# EAGLE design EFR32MG22_module (EAGLE 9.6.2)
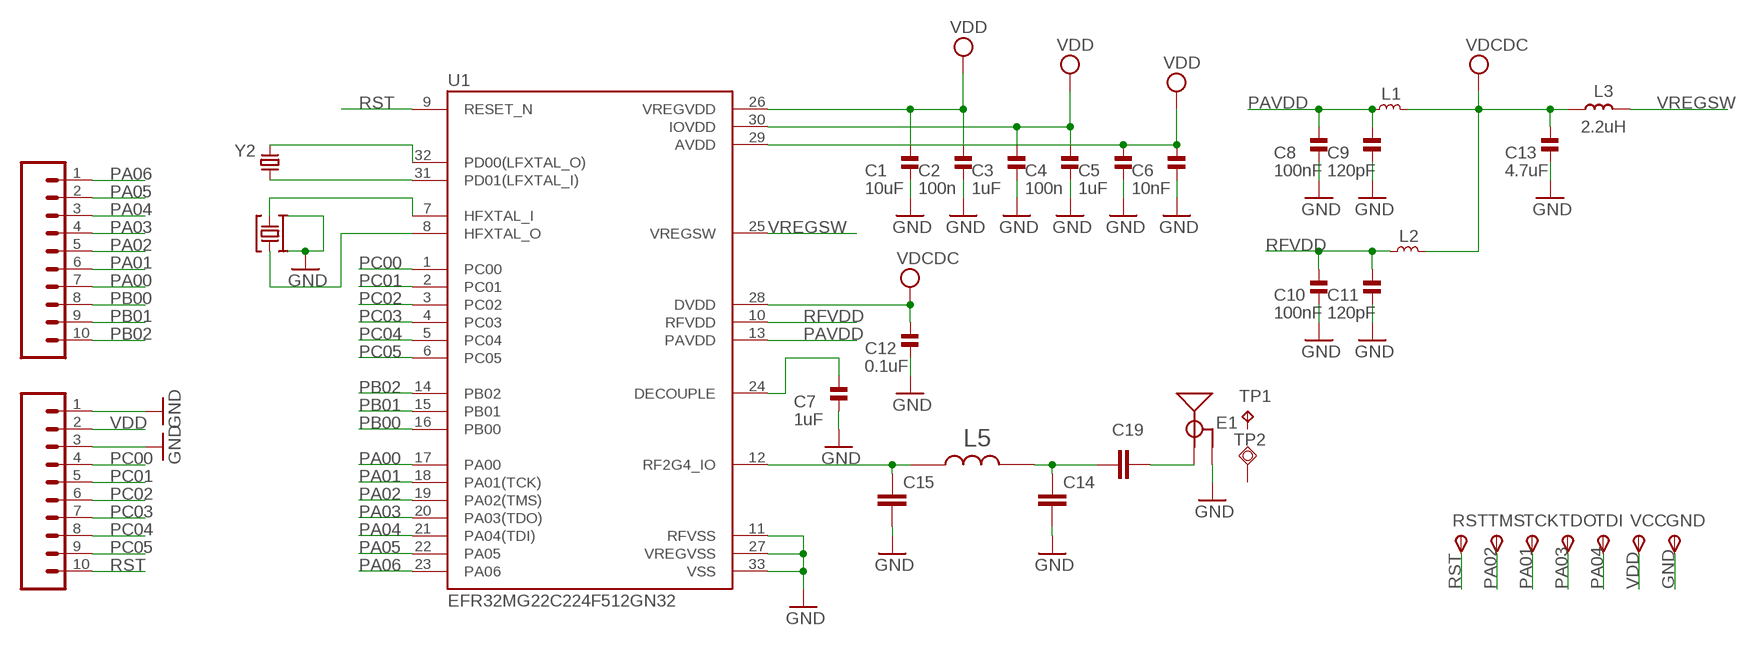
[diagram p0: schematic, sheet 1]

## Parts
C1  10uF  CAP-0805  [_PKG_C_0805]
C2  100n  CAP-0402  [_PKG_C_0402]
C3  1uF  CAP-0402  [_PKG_C_0402]
C4  100n  CAP-0402  [_PKG_C_0402]
C5  1uF  CAP-0402  [_PKG_C_0402]
C6  10nF  CAP-0402  [_PKG_C_0402]
C7  1uF  CAP-0402  [_PKG_C_0402]
C8  100nF  CAP-0402  [_PKG_C_0402]
C9  120pF  CAP-0402  [_PKG_C_0402]
C10  100nF  CAP-0402  [_PKG_C_0402]
C11  120pF  CAP-0402  [_PKG_C_0402]
C12  0.1uF  CAP-0402  [_PKG_C_0402]
C13  4.7uF  CAP-0402  [_PKG_C_0402]
C14  1.3pF  CAP0402  [CAPC1005X40N]
C15  1.2pF  CAP0402  [CAPC1005X40N]
C19  18pF  CAP0402  [CAPC1005X40N]
E1  ANTENNA-GROUNDEDTRACE-15.2MM  [TRACE_ANTENNA_2.4GHZ_15.2MM]
GND  TPSTP11R  [TP11R]
J1  CONN_061.27MM  [1X06_1.27MM]
J2  CONN_061.27MM  [1X06_1.27MM]
L1  BLM18AG102SN1  INDUCTOR-0603  [_PKG_L_0603]
L2  BLM18AG102SN1  INDUCTOR-0603  [_PKG_L_0603]
L3  2.2uH  L_CHIP-1008(2520-METRIC)  [INDC2520X120N]
L5  2.6nH  IND0402IND0402  [INDC1005X40N]
RST  TPSTP11R  [TP11R]
TCK  TPSTP11R  [TP11R]
TDI  TPSTP11R  [TP11R]
TDO  TPSTP11R  [TP11R]
TMS  TPSTP11R  [TP11R]
TP1  TPTP06SQ  [TP05SQ]
TP2  TPSQTP15SQ  [TP15SQ]
U1  EFR32MG22C224F512GN32  [QFN50P500X500X90-33N]
VCC  TPSTP11R  [TP11R]
Y1  38.4MHZ  48.000MHZ_CX2016DB48000C0FPLC1  [XTAL-4P-2016]
Y2  32.768KHz  32.768KHZ_Q13FC1350000400  [XTAL-2P-3215]

## Nets
GND: C1.2 C2.2 C3.2 C4.2 C5.2 C6.2 C7.2 C8.2 C9.2 C10.2 C11.2 C12.2 C13.2 C14.2 C15.2 E1.GND GND.TP(PP) J2.1 J2.3 U1.11(RFVSS) U1.27(VREGVSS) U1.33(VSS) Y1.2 Y1.4
N$1: C15.1 L5.1 U1.12(RF2G4_IO)
N$2: C7.1 U1.24(DECOUPLE)
N$3: U1.7(HFXTAL_I) Y1.3
N$5: U1.31(PD01(LFXTAL_I)) Y2.2
N$6: U1.32(PD00(LFXTAL_O)) Y2.1
N$7: C14.1 C19.1 L5.2
N$8: C19.2 E1.ANT(SIGNAL)
N$9: U1.8(HFXTAL_O) Y1.1
PA00: J1.7 U1.17(PA00)
PA01: J1.6 TCK.TP(PP) U1.18(PA01(TCK))
PA02: J1.5 TMS.TP(PP) U1.19(PA02(TMS))
PA03: J1.4 TDO.TP(PP) U1.20(PA03(TDO))
PA04: J1.3 TDI.TP(PP) U1.21(PA04(TDI))
PA05: J1.2 U1.22(PA05)
PA06: J1.1 U1.23(PA06)
PAVDD: C8.1 C9.1 L1.1 U1.13(PAVDD)
PB00: J1.8 U1.16(PB00)
PB01: J1.9 U1.15(PB01)
PB02: J1.10 U1.14(PB02)
PC00: J2.4 U1.1(PC00)
PC01: J2.5 U1.2(PC01)
PC02: J2.6 U1.3(PC02)
PC03: J2.7 U1.4(PC03)
PC04: J2.8 U1.5(PC04)
PC05: J2.9 U1.6(PC05)
RFVDD: C10.1 C11.1 L2.1 U1.10(RFVDD)
RST: J2.10 RST.TP(PP) U1.9(RESET_N)
VDD: C1.1 C2.1 C3.1 C4.1 C5.1 C6.1 J2.2 U1.26(VREGVDD) U1.29(AVDD) U1.30(IOVDD) VCC.TP(PP)
VPP: C12.1 C13.1 L1.2 L2.2 L3.1 U1.28(DVDD) ; supply symbol labelled VDCDC
VREGSW: L3.2 U1.25(VREGSW)
Unconnected: TP1.TP TP2.TP

## Library data of the parts
C1-C13 = ok-discretes-dev:CAP
C14 C15 C19 = discretes-dev:CAP0402: CAP, 0402; AVAILABILITY: Good; DESCRIPTION: RESISTOR, 0402 0.063W 1% 3M6; Resistance:3.6Mohm; Resistance Tolerance:± 1%; Power Rating:0.063W; Voltage Rating:50V; Series:RC32H; Temperature Coefficient:± 100ppm/°C; Resistor Element Type:Thick Film; Resistor Case Style:0402; No. of Pins:2; SVHC:No SVHC; Case Style:0402; External Length / Height:1mm; Temperature Coeff. +:100ppm/°C; Temperature Coeff. -:100ppm/°C; External Depth:0.35mm; External Width:0.5mm; Operating Temperature Range:-55°C to +155°C; Overload Voltage:100V; MF: Yageo; MP: RC0402FR-073M6L; PACKAGE: 1005 Panasonic Electronic Components; PRICE: None; PURCHASE-URL: https://pricing.snapeda.com/search/part/RC0402FR-073M6L/?ref=eda
E1 = SparkFun-RF:ANTENNA-GROUNDED: Antenna w/ Ground Connection 2.4GHz antennae with signal and ground terminals. TRACE_ANTENNA_2.4GHZ_15.2MM - Meander Trace antenna 15.2 x 5.7mm footprint Based on layout from TI app note AN043 <http://www.ti.com/lit/an/swra117d/swra117d.pdf>. TRACE_ANTENNA_2.4GHZ_25.7MM - Inverted F trace antenna 25.7 x 7.5 mm footprint. Based on layout from TI design note DN0007 <http://www.ti.com/lit/an/swru120b/swru120b.pdf>.
GND RST TCK TDI TDO TMS VCC = testpad:TPS: TEST PIN
J1 J2 = SparkFun-Connectors:CONN_06: Multi connection point. Often used as Generic Header-pin footprint for 0.1 inch spaced/style header connections On any of the 0.1 inch spaced packages, you can populate with these: Break Away Headers - Straight <https://www.sparkfun.com/products/116> (PRT-00116) Break Away Male Headers - Right Angle <https://www.sparkfun.com/products/553> (PRT-00553) Female Headers <https://www.sparkfun.com/products/115> (PRT-00115) Break Away Headers - Machine Pin <https://www.sparkfun.com/products/117> (PRT-00117) Break Away Female Headers - Swiss Machine Pin <https://www.sparkfun.com/products/743> (PRT-00743) Arduino Stackable Header - 6 Pin <https://www.sparkfun.com/products/9280> (PRT-09280) For SCREWTERMINALS and SPRING TERMINALS visit here: Screw Terimnals on SparkFun.com <https://www.sparkfun.com/search/results?term=Screw+Terminals> (5mm/3.5mm/2.54mm spacing) This device is also useful as a general connection point to wire up your design to another part of your project. Our various solder wires solder well into these plated through hole pads. Hook-Up Wire - Assortment (Stranded, 22 AWG) <https://www.sparkfun.com/products/11375> (PRT-11375) Hook-Up Wire - Assortment (Solid Core, 22 AWG) <https://www.sparkfun.com/products/11367> (PRT-11367) View the entire wire category on our website here <https://www.sparkfun.com/categories/141>
L1 L2 = ok-discretes-dev:INDUCTOR
L3 = Inductor:L: Inductor Fixed - Generic; CATEGORY: Inductor; SUB-CATEGORY: Fixed
L5 = discretes-dev:IND0402: RESISTOR, 0402 0.063W 1% 3M6; Resistance:3.6Mohm; Resistance Tolerance:± 1%; Power Rating:0.063W; Voltage Rating:50V; Series:RC32H; Temperature Coefficient:± 100ppm/°C; Resistor Element Type:Thick Film; Resistor Case Style:0402; No. of Pins:2; SVHC:No SVHC; Case Style:0402; External Length / Height:1mm; Temperature Coeff. +:100ppm/°C; Temperature Coeff. -:100ppm/°C; External Depth:0.35mm; External Width:0.5mm; Operating Temperature Range:-55°C to +155°C; Overload Voltage:100V Check prices <https://pricing.snapeda.com/parts/RC0402FR-073M6L/Yageo/view-part?ref=eda>; AVAILABILITY: Good; DESCRIPTION: RESISTOR, 0402 0.063W 1% 3M6; Resistance:3.6Mohm; Resistance Tolerance:± 1%; Power Rating:0.063W; Voltage Rating:50V; Series:RC32H; Temperature Coefficient:± 100ppm/°C; Resistor Element Type:Thick Film; Resistor Case Style:0402; No. of Pins:2; SVHC:No SVHC; Case Style:0402; External Length / Height:1mm; Temperature Coeff. +:100ppm/°C; Temperature Coeff. -:100ppm/°C; External Depth:0.35mm; External Width:0.5mm; Operating Temperature Range:-55°C to +155°C; Overload Voltage:100V; MF: Yageo; MP: RC0402FR-073M6L; PACKAGE: 1005 Panasonic Electronic Components; PRICE: None; PURCHASE-URL: https://pricing.snapeda.com/search/part/RC0402FR-073M6L/?ref=eda
TP1 = testpad:TP: Test pad
TP2 = testpad:TPSQ: Test pad
U1 = EFR32MG22C224F512GN32:EFR32MG22C224F512GN32: SOC EFR32 ARM Cortex M33 32-Pin QFN; AVAILABILITY: In Stock; DESCRIPTION: MIGHTY PREMIUM QFN32 2.4G 19.5DB; MF: Silicon Labs; MP: EFR32MG14P732F256GM32-B; PACKAGE: QFN-32 Silicon Labs; PRICE: None
Y1 = ok-xtal-osc-dev:48.000MHZ_CX2016DB48000C0FPLC1: 48MHz ±10ppm Crystal 7pF 50 Ohms 4-SMD, No Lead Datasheet <https://media.digikey.com/pdf/Data%20Sheets/Kyocera%20International/CX2016DB48000C0FPLC1_DS.pdf>; DIGIKEY_PART: 1253-2042-1-ND; MFG_NAME: KYOCERA; MFG_PART: CX2016DB48000C0FPLC1
Y2 = ok-xtal-osc-dev:32.768KHZ_Q13FC1350000400: SMD Crystal Resonators 32.768KHz +/-20ppm SMD-3215_2P RoHS Datasheet <https://datasheet.lcsc.com/szlcsc/1901081604_Seiko-Epson-Q13FC1350000400_C32346.pdf>; LCSC_PART: C32346; MFG_NAME: SEIKO EPSON; MFG_PART: Q13FC1350000400

## Board
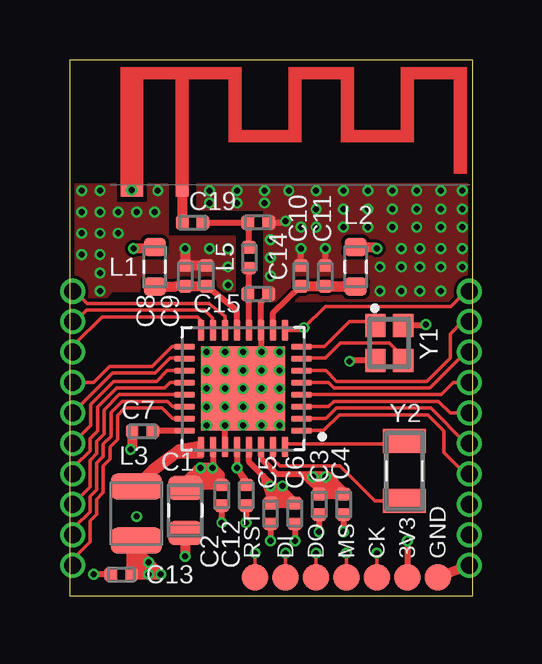
[diagram p1: board, top side]
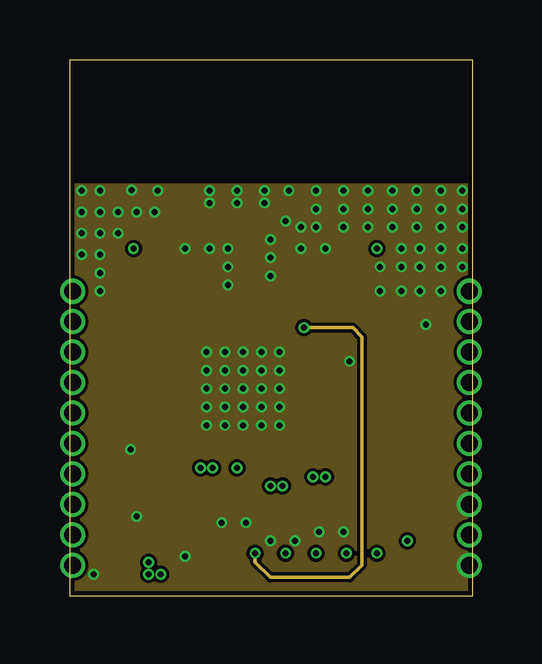
[diagram p2: board, inner layer Route2]
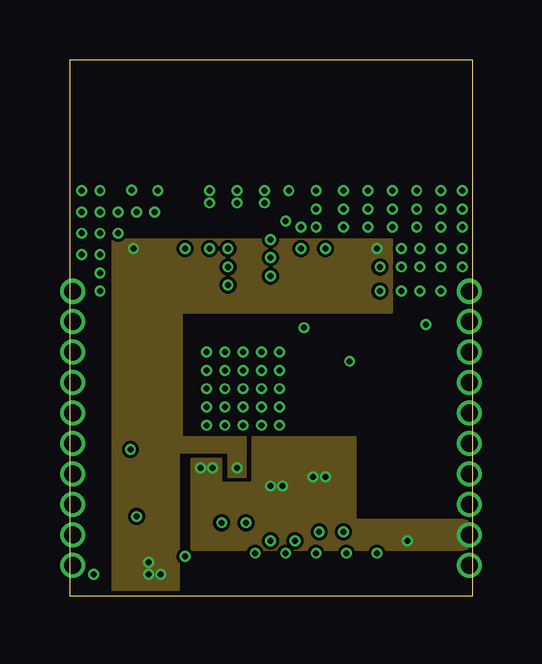
[diagram p3: board, inner layer Route15]
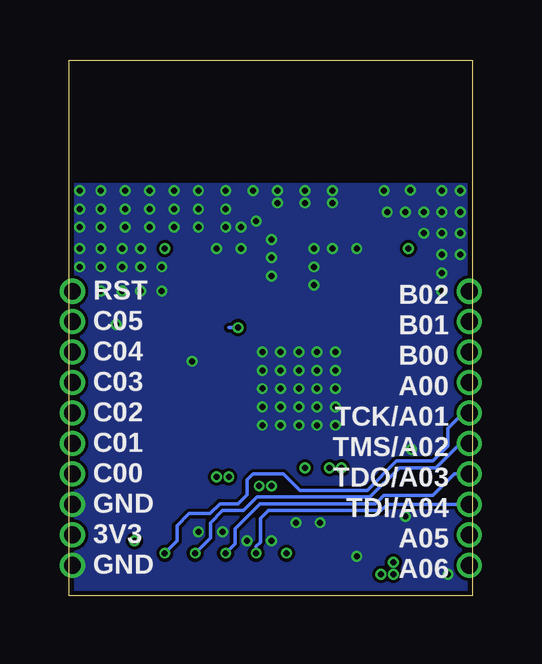
[diagram p4: board, bottom side, seen from below]

Size 16.82 x 22.34 mm. Coordinates in mm from the lower left corner, seen from the top.
Outline: 0,0 16.82,0 16.82,22.34 0,22.34 0,0
Copper layers (1*2*15*16): Top 0.035mm / dielectric 0.17mm / Route2 0.017mm / dielectric 0.4mm / Route15 0.017mm / dielectric 0.17mm / Bottom 0.035mm
Design rules "default *": minimum track width 6mil, minimum drill 0.2mm, track to track 5mil, track to pad 5mil, pad to pad 5mil, via to via 5mil, smd to smd 5mil, copper to edge 0.2mm, drill to drill 0.2mm, minimum pad ring 4mil, minimum via ring 4mil, stop-mask expansion 2.5mil, vias tented up to drill 0.25mm, thermal gap 10mil

### Footprints (pad centres in the part's own frame; a part is rotated, then mirrored left to right if it is on the bottom)
_PKG_C_0805 = smd 1 x 1.42: 1 -0.935,0; 2 0.935,0
_PKG_C_0402 = smd 0.54 x 0.6: 1 -0.43,0; 2 0.43,0
CAPC1005X40N = smd 0.54 x 0.6: 1 -0.432,0; 2 0.432,0
TRACE_ANTENNA_2.4GHZ_15.2MM = smd 0.5 x 0.5: ANT 0,-0.25 | smd 0.9 x 0.5: GND -2.1,-0.25
TP11R = smd 1.1 x 1.1: TP 0,0
1X06_1.27MM = drill 0.7 pad 1: 1 0,0; 2 1.27,0; 3 2.54,0; 4 3.81,0; 5 5.08,0; 6 6.35,0; 7 7.62,0; 8 8.89,0; 9 10.16,0; 10 11.43,0
_PKG_L_0603 = smd 0.79 x 0.93: 1 -0.82,0; 2 0.82,0
INDC2520X120N = smd 1.079 x 2.129: 1 -1.125,0; 2 1.125,0
INDC1005X40N = smd 0.54 x 0.6: 1 -0.432,0; 2 0.432,0
TP05SQ = smd 0.5 x 0.5: TP 0,0
TP15SQ = smd 0.5 x 0.9: TP 0,0
QFN50P500X500X90-33N = smd 0.86 x 0.26: 1 -2.435,1.75; 2 -2.435,1.25; 3 -2.435,0.75; 4 -2.435,0.25; 5 -2.435,-0.25; 6 -2.435,-0.75; 7 -2.435,-1.25; 8 -2.435,-1.75; 17 2.435,-1.75; 18 2.435,-1.25; 19 2.435,-0.75; 20 2.435,-0.25; 21 2.435,0.25; 22 2.435,0.75; 23 2.435,1.25; 24 2.435,1.75 | smd 0.26 x 0.86: 9 -1.75,-2.435; 10 -1.25,-2.435; 11 -0.75,-2.435; 12 -0.25,-2.435; 13 0.25,-2.435; 14 0.75,-2.435; 15 1.25,-2.435; 16 1.75,-2.435; 25 1.75,2.435; 26 1.25,2.435; 27 0.75,2.435; 28 0.25,2.435; 29 -0.25,2.435; 30 -0.75,2.435; 31 -1.25,2.435; 32 -1.75,2.435 | smd 3.5 x 3.5: 33 0,0
XTAL-4P-2016 = smd 0.95 x 0.85: 1 -0.725,-0.575; 2 0.725,-0.575; 3 0.725,0.575; 4 -0.725,0.575
XTAL-2P-3215 = smd 1 x 1.8: 1 -1.25,0; 2 1.25,0

### Placement (x,y rotation side)
C1  4.83,3.56 270 top
C2  6.35,4.19 270 top
C3  10.41,3.81 270 top
C4  11.43,3.81 270 top
C5  8.38,3.43 270 top
C6  9.4,3.43 270 top
C7  3.05,6.86 180 top
C8  4.83,13.34 90 top
C9  5.71,13.34 90 top
C10  9.65,13.34 90 top
C11  10.67,13.34 90 top
C12  7.37,4.19 270 top
C13  2.16,0.89 180 top
C14  7.87,15.56 0 top
C15  7.87,12.57 0 top
C19  5.13,15.56 180 top
E1  4.7,17.14 0 top
GND  15.37,0.76 0 top
J1  0.13,1.27 90 top
J2  16.68,1.27 90 top
L1  3.56,13.72 90 top
L2  11.94,13.72 90 top
L3  2.79,3.43 90 top
L5  7.49,14.1 90 top
RST  7.75,0.76 0 top
TCK  12.83,0.76 0 top
TDI  9.02,0.76 0 top
TDO  10.29,0.76 0 top
TMS  11.56,0.76 0 top
TP1  4.7,16.9 0 top
TP2  2.6,16.9 90 top
U1  7.24,8.64 180 top
VCC  14.1,0.76 0 top
Y1  13.34,10.54 270 top
Y2  13.97,5.21 270 top

### Tracks (layer width: path | path; a pad name or v marks a point on that pad's centre or on a via)
GND  (via drill 0.25)
  Top 0.152: v2.59,16.9 E1.GND v2.59,16.9 v2.59,16.91
  Top 0.254: v8,9.4 U1.11 7.99,12.26 C15.2 | U1.27 v6.49,7.1 v6.48,7.11 | C5.2 v8.38,2.29 | C6.2 v9.4,2.29 | C3.2 v10.41,2.67 | C4.2 v11.43,2.67 | C12.2 v7.37,3.05 | C2.2 v6.35,3.05 | C10.2 v9.65,14.48 | C11.2 v10.67,14.48 | C14.2 8.96,15.56 v9.02,15.62 | C13.2 v1.02,0.89 | v14.86,11.3 14.82,11.27 Y1.4 | Y1.2 11.72,9.82 v11.68,9.78
  Top 0.406: C7.2 2.62,6.17 v2.54,6.1 | C9.2 C8.2 v4.83,14.48 | C1.2 v4.83,1.65 | J2.1 GND.TP
  other vias: 5.71,10.16 8.76,10.16 7.24,10.16 6.48,10.16 8,10.16 5.71,7.11 8.76,7.11 5.71,8.64 5.71,9.4 5.71,7.87 7.24,7.11 8,7.11 8.76,8.64 8.76,9.4 8.76,7.87 6.48,9.4 7.24,9.4 6.48,8.64 6.48,7.87 7.24,8.64 7.24,7.87 8,8.64 8,7.87 0.51,16 0.51,15.11 0.51,14.22 1.27,16 1.27,15.11 1.27,14.22 2.03,16 2.79,16 3.56,16 9.65,15.37 11.43,15.37 12.45,15.37 13.46,15.37 14.48,15.37 15.49,15.37 16.38,15.37 13.84,14.48 15.49,14.48 16.38,14.48 13.84,13.72 15.49,13.72 16.38,13.72 13.84,12.7 15.49,12.7 12.45,16.13 13.46,16.13 14.48,16.13 15.49,16.13 16.38,16.13 2.03,15.11 1.27,13.46 14.61,14.48 14.61,13.72 14.61,12.7 6.6,12.95 8.38,14.86 8.38,13.34 11.43,16.13 10.29,15.37 12.95,12.7 12.95,13.72 6.6,14.48 5.84,14.48 6.6,13.72 2.79,3.3 8.38,14.1 1.27,12.7 11.43,16.89 12.45,16.89 13.46,16.89 14.48,16.89 15.49,16.89 16.38,16.89 10.29,16.89 10.29,16.13 9.14,16.89 8.13,16.89 6.99,16.89 5.84,16.89 3.68,16.89 0.51,16.89 1.27,16.89 5.84,16.38 6.99,16.38 8.13,16.38
  pour Bottom (no thermals): 16.76,17.14 16.76,-0.13 0,-0.13 0,17.14
  pour Route2 (no thermals): 0,17.14 16.76,17.14 16.76,-0.13 0,-0.13
  pour Top (no thermals): 0,17.14 1.91,17.14 1.91,16.38 3.3,16.38 3.3,17.14 4.06,17.14 4.06,14.99 6.86,14.99 6.86,12.7 1.78,12.7 1.4,12.32 0,12.32
  pour Top (no thermals): 5.33,17.14 5.33,16.13 8.13,16.13 8.13,12.32 16.76,12.32 16.76,17.14
N$1
  Top 0.254: U1.12 7.49,12.57 C15.1 7.49,12.62 L5.1
N$2
  Top 0.254: C7.1 3.51,6.89 U1.24
N$3
  Top 0.152: U1.7 9.69,9.91 10.67,9.91 11.3,10.54 13.34,10.54 13.91,9.97 Y1.3
N$5
  Top 0.152: 13.95,3.97 Y2.2 12.74,3.96 11.29,5.41 8.77,5.41 8.49,5.69 U1.31
N$6
  Top 0.152: Y2.1 13.84,6.33 8.99,6.33 U1.32
N$7
  Top 0.254: L5.2 7.49,15.51 C14.1 | 7.42,15.59 C14.1 | C19.1 C14.1
N$8
  Top 0.406: E1.ANT C19.2
N$9
  Top 0.152: Y1.1 12.6,11.43 11.68,11.43 10.64,10.39 U1.8
PA00
  Top 0.152: 0.24,8.89 0.24,9.13 | J1.7 0.24,8.89 | U1.17 4.28,10.39 3.45,9.56 1.68,9.56 1,8.89 0.24,8.89
PA01  (via drill 0.25)
  Top 0.152: J1.6 0.24,7.62 0.24,7.73 1.79,9.28 3.57,9.28 4.19,9.91 4.78,9.91 U1.18 | TCK.TP v12.83,1.78
  Bottom 0.152: v12.83,1.78 12.32,2.29 12.32,2.92 11.81,3.43 10.94,3.43 10.53,3.83 9.78,3.83 9.4,4.22 9.4,4.83 9.14,5.08 7.87,5.08 7.19,4.39 4.38,4.39 3.16,5.61 1.65,5.61 1.02,6.25 1.02,6.99 0.38,7.62 J1.6
PA02  (via drill 0.25)
  Top 0.152: J1.5 0.24,6.35 0.24,6.46 0.89,7.11 0.89,7.99 1.85,8.95 3.62,8.95 4.07,9.39 U1.19 | TMS.TP v11.56,1.78
  Bottom 0.152: v11.56,1.78 10.92,2.41 10.92,3.05 10.41,3.56 9.54,3.56 8.98,4.12 4.27,4.12 3.05,5.33 1.52,5.33 0.51,6.35 J1.5
PA03  (via drill 0.25)
  Top 0.152: J1.4 0.24,5.08 0.24,5.43 0.85,6.05 0.85,6.56 1.17,6.87 1.17,7.87 1.96,8.66 3.97,8.66 4.19,8.89 U1.20 | TDO.TP v10.29,1.78
  Bottom 0.152: v10.29,1.78 9.91,2.16 9.91,2.79 8.87,3.83 4.04,3.83 3.68,4.19 1.65,4.19 0.76,5.08 J1.4 0.38,5.08
PA04  (via drill 0.25)
  Top 0.152: U1.21 2.08,8.39 1.45,7.75 1.45,6.75 1.14,6.44 1.14,5.93 0.85,5.65 0.85,4.54 0.24,3.92 0.24,3.81 J1.3 | TDI.TP v9.02,1.78
  Bottom 0.152: J1.3 3.56,3.81 3.81,3.56 8.51,3.56 8.84,3.22 8.84,2.23 9.02,2.06 v9.02,1.78
PA05
  Top 0.152: U1.22 4.31,7.89 4.08,8.11 2.19,8.11 1.73,7.64 1.73,6.64 1.41,6.33 1.41,5.82 1.14,5.54 1.14,4.42 0.85,4.14 0.85,3.51 0.24,2.89 0.24,2.54 J1.2
PA06
  Top 0.152: U1.23 4.3,7.39 3.86,7.83 2.31,7.83 2.01,7.52 2.01,6.52 1.69,6.21 1.69,5.7 1.41,5.42 1.41,4.31 1.14,4.03 1.14,3.39 0.85,3.11 0.85,2.24 0.24,1.62 0.24,1.27 J1.1
PAVDD
  Top 0.254: U1.13 6.98,11.89 C9.1
  Top 0.406: L1.1 4.45,12.9 C9.1 C8.1
PB00
  Top 0.152: 0.25,10.29 J1.8 0.24,10.16 0.24,10.51 1.36,11.63 5.33,11.63 5.49,11.48 U1.16
PB01
  Top 0.152: U1.15 5.97,11.09 5.97,11.58 5.64,11.91 0.72,11.91 0.24,11.43 J1.9
PB02
  Top 0.152: U1.14 6.48,11.08 6.48,11.67 6.47,11.67 5.82,12.19 0.74,12.19 0.24,12.7 J1.10
PC00
  Top 0.152: U1.1 10.6,6.89 11.26,7.55 14.95,7.55 15.62,6.87 15.62,5.97 16.51,5.08 J2.4
PC01
  Top 0.152: U1.2 10.7,7.39 11.14,7.83 15.06,7.83 16.54,6.35 J2.5
PC02
  Top 0.152: U1.3 10.81,7.89 11.03,8.11 15.39,8.11 15.88,7.62 J2.6
PC03
  Top 0.152: U1.4 15.5,8.39 16,8.89 16.38,8.89 16.54,8.89 J2.7
PC04
  Top 0.152: U1.5 10.8,8.89 11.02,8.66 15.03,8.66 16.52,10.16 J2.8
PC05
  Top 0.152: 9.69,9.4 U1.6 10.69,9.39 11.13,8.95 14.91,8.95 15.88,9.91 15.88,10.92 16.38,11.43 J2.9
RFVDD
  Top 0.254: U1.10 8.49,11.79 C10.1
  Top 0.406: C10.1 10.79,12.9 L2.1 C11.1
RST  (via drill 0.25)
  Top 0.152: U1.9 9.67,11.07 v9.78,11.18 10.67,12.06 15.9,12.06 16.54,12.7 J2.10 | RST.TP v7.75,1.78
  Route2 0.152: v9.78,11.18 11.81,11.18 12.19,10.79 12.19,1.27 11.68,0.76 8.38,0.76 7.75,1.4 v7.75,1.78
  Bottom 0.152: 10.16,11.18 v9.78,11.18
VDD  (via drill 0.25)
  Top 0.254: C1.1 4.87,4.6 | 8.38,3.94 C5.1 8.38,3.99 8.34,4.14 | U1.30 7.99,5.73 8.64,5.08 9.65,5.08 | U1.26 5.99,5.35 | 5.99,5.35 v5.97,5.33 6.1,5.33 6.35,5.08 6.35,4.7 | C2.1 5.99,4.98 5.99,5.35 | C3.1 10.37,4.24 | 9.65,5.08 9.98,4.77 | 9.98,4.77 10.31,4.46 | C3.1 10.31,4.34 10.31,4.46 | 8.34,4.14 8.26,4.41 | 8.26,4.41 8.14,4.79 | 8.14,4.79 8.1,4.91 | 8.07,5.01 8.1,4.91 | U1.29 7.49,5.59 8.07,5.01 | 8.44,4.57 v8.38,4.57 | v8.38,4.57 8.36,4.57 8.14,4.79 | 8.8,4.28 8.74,4.34 8.67,4.41 8.26,4.41 | v8.89,4.57 8.51,4.57 | 8.51,4.57 8.44,4.57 | 8.44,4.57 8.1,4.91 | 8.07,5.01 8.51,4.57 | v8.38,4.57 8.38,4.18 8.34,4.14 | 9.65,5.08 10.03,5.08 | 10.03,5.08 10.16,5.08 | 10.41,5.08 10.79,5.08 | 10.16,5.08 10.41,5.08 | 10.41,5.08 10.77,4.72 | 10.77,4.72 10.9,4.72 10.79,4.83 10.79,5.08 | 10.77,4.72 10.52,4.72 10.16,5.08 | 10.03,5.08 v10.16,4.95 10.31,4.8 | 10.31,4.8 10.31,4.46 | 10.31,4.8 10.41,4.7 C3.1 | 10.03,5.08 10.03,4.82 9.98,4.77 | 10.79,5.08 11.43,4.45 C4.1 | v14.1,2.29 VCC.TP
  Top 0.406: 10.92,4.24 C3.1 10.9,4.72 | 10.92,4.24 C4.1 10.92,4.75 10.92,4.24 | 8.89,3.86 C6.1 8.89,4.37 | 8.89,3.86 C5.1 8.8,4.28 | 5.59,4.62 C2.1 6.35,4.7 6.35,4.75 5.84,5.26 5.84,5.33 v5.46,5.33 5.46,5.13 | 5.59,4.62 5.29,4.62 5.02,4.89 4.83,4.7 C1.1 4.95,4.62 4.95,4.87 5.33,5.25 5.46,5.13 | 5.84,5.13 5.84,4.88 5.59,4.62 | 5.59,4.62 5.59,5 5.46,5.13 | 8.89,4.49 8.89,4.37 | 8.89,4.37 8.89,3.86 | 8.74,4.34 8.89,4.49 | v8.89,4.57 8.89,4.49
  other vias: 10.67,4.95
  pour Route15 (no thermals): 7.62,6.6 7.62,4.7 6.35,4.7 6.35,5.71 5.08,5.71 5.08,1.91 17.02,1.91 17.02,3.17 11.94,3.17 11.94,6.6
VPP  (via drill 0.25)
  Top 0.254: 7.28,4.7 C12.1 | U1.28 v6.99,5.34 | v6.99,5.34 v6.99,5.33 7.07,5.21 | C12.1 7.34,4.68 | 7.34,4.68 v6.99,5.34 | C12.1 7.34,4.65 7.34,4.68 | 7.34,4.68 7.34,4.83 7.07,5.21 | C12.1 7.07,5.21
  Top 0.406: L1.2 3.5,14.48 v2.67,14.48 | L2.2 12.77,14.54 v12.83,14.48 | 2.75,2.25 L3.1 2.59,2.1 2.59,2.03 | 2.59,1.4 C13.1 3.1,0.89 | 2.59,1.4 2.59,1.73 | 3.1,0.89 v3.3,0.89 3.43,0.89 | 3.1,0.89 2.59,1.4 | 3.43,0.89 2.59,1.73 | 2.59,1.73 2.59,2.03 | 3.43,0.89 v3.81,0.89 v3.3,1.4 2.67,2.03 2.59,2.03
  pour Route15 (no thermals): 6.6,5.97 6.6,4.95 7.37,4.95 7.37,6.6 4.7,6.6 4.7,11.81 13.46,11.81 13.46,14.86 1.78,14.86 1.78,0.25 4.57,0.25 4.57,5.97
VREGSW
  Top 0.254: 5.33,6.2 5.46,6.2 | 4.28,5.84 5.49,5.84 U1.25
  Top 0.508: 4.28,5.84 4.59,6.08 5.33,6.2 | 4.28,5.84 3.45,5.21 L3.2

### Text on the board
tNames: RST | DI | DO | MS | CK | 3V3 | GND
bNames: B02 | B01 | RST | C05 | B00 | C04 | A00 | C03 | TCK/A01 | TMS/A02 | C02 | C01 | TDO/A03 | C00 | TDI/A04 | A05 | GND | A06 | 3V3 | GND